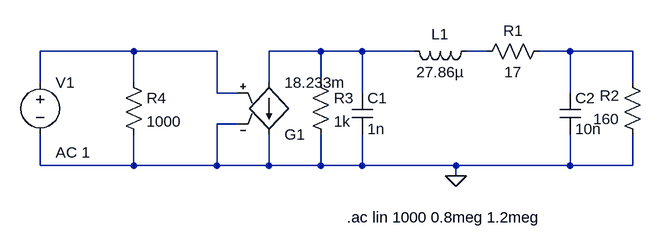
[diagram p0: schematic PruebaLC.asc]
PruebaLC.asc, the LTspice schematic file:
Version 4
SHEET 1 880 680
WIRE -288 112 -432 112
WIRE -160 112 -288 112
WIRE 0 112 -80 112
WIRE 64 112 0 112
WIRE 144 112 64 112
WIRE 256 112 224 112
WIRE 384 112 336 112
WIRE 480 112 384 112
WIRE -432 160 -432 112
WIRE -288 160 -288 112
WIRE -80 160 -80 112
WIRE 0 160 0 112
WIRE 480 160 480 112
WIRE -160 176 -160 112
WIRE -128 176 -160 176
WIRE 64 176 64 112
WIRE 384 176 384 112
WIRE -128 224 -160 224
WIRE -432 288 -432 240
WIRE -288 288 -288 240
WIRE -288 288 -432 288
WIRE -160 288 -160 224
WIRE -160 288 -288 288
WIRE -80 288 -80 240
WIRE -80 288 -160 288
WIRE 0 288 0 240
WIRE 0 288 -80 288
WIRE 64 288 64 240
WIRE 64 288 0 288
WIRE 208 288 64 288
WIRE 384 288 384 240
WIRE 384 288 208 288
WIRE 480 288 480 240
WIRE 480 288 384 288
WIRE 208 304 208 288
FLAG 208 304 0
SYMBOL ind 240 96 R90
WINDOW 0 5 56 VBottom 2
WINDOW 3 32 56 VTop 2
SYMATTR InstName L1
SYMATTR Value 27.86µ
SYMBOL cap 48 176 R0
SYMATTR InstName C1
SYMATTR Value 1n
SYMBOL cap 368 176 R0
SYMATTR InstName C2
SYMATTR Value 10n
SYMBOL res 352 96 R90
WINDOW 0 0 56 VBottom 2
WINDOW 3 32 56 VTop 2
SYMATTR InstName R1
SYMATTR Value 17
SYMBOL res 496 256 R180
WINDOW 0 36 76 Left 2
WINDOW 3 36 40 Left 2
SYMATTR InstName R2
SYMATTR Value 160
SYMBOL g2 -80 256 M180
SYMATTR InstName G1
SYMATTR Value 18.233m
SYMBOL res -16 144 R0
SYMATTR InstName R3
SYMATTR Value 1k
SYMBOL res -304 144 R0
SYMATTR InstName R4
SYMATTR Value 1000
SYMBOL voltage -432 144 R0
WINDOW 123 24 124 Left 2
WINDOW 39 0 0 Left 2
SYMATTR InstName V1
SYMATTR Value ""
SYMATTR Value2 AC 1
TEXT 40 368 Left 2 !.ac lin 1000 0.8meg 1.2meg

The netlist it stands for:
* PruebaLC.asc
L1 N003 N002 27.86µ
C1 N002 0 1n
C2 N004 0 10n
R1 N004 N003 17
R2 0 N004 160
G1 N002 0 N001 0 18.233m
R3 N002 0 1k
R4 N001 0 1000
V1 N001 0 AC 1
.ac lin 1000 0.8meg 1.2meg
.backanno
.end